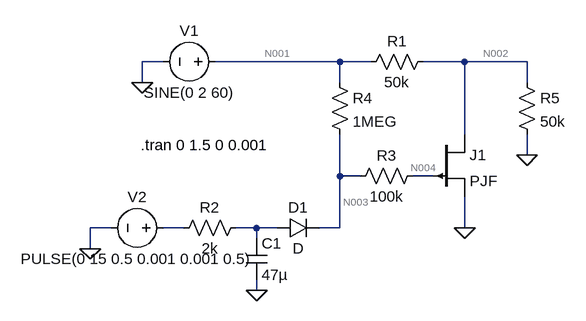
[diagram p0: schematic mute2.asc]
mute2.asc, the LTspice schematic file:
Version 4
SHEET 1 880 680
WIRE -304 -16 -336 -16
WIRE -32 -16 -224 -16
WIRE 16 -16 -32 -16
WIRE 160 -16 96 -16
WIRE 256 -16 160 -16
WIRE -336 16 -336 -16
WIRE -32 16 -32 -16
WIRE 256 16 256 -16
WIRE 160 96 160 -16
WIRE 256 128 256 96
WIRE -32 160 -32 96
WIRE 0 160 -32 160
WIRE 112 160 80 160
WIRE -384 240 -416 240
WIRE -272 240 -304 240
WIRE -160 240 -192 240
WIRE -128 240 -160 240
WIRE -32 240 -32 160
WIRE -32 240 -64 240
WIRE 160 240 160 192
WIRE -160 256 -160 240
WIRE -416 272 -416 240
WIRE -160 336 -160 320
FLAG -336 16 0
FLAG 256 128 0
FLAG -416 272 0
FLAG -160 336 0
FLAG 160 240 0
SYMBOL voltage -208 -16 R90
WINDOW 0 -32 56 VBottom 2
WINDOW 3 32 56 VTop 2
WINDOW 123 0 0 Left 2
WINDOW 39 0 0 Left 2
SYMATTR InstName V1
SYMATTR Value SINE(0 2 60)
SYMBOL voltage -288 240 R90
WINDOW 0 -32 56 VBottom 2
WINDOW 3 32 56 VTop 2
WINDOW 123 0 0 Left 2
WINDOW 39 0 0 Left 2
SYMATTR InstName V2
SYMATTR Value PULSE(0 15 0.5 0.001 0.001 0.5)
SYMBOL cap -176 256 R0
SYMATTR InstName C1
SYMATTR Value 47µ
SYMBOL res -176 224 R90
WINDOW 0 0 56 VBottom 2
WINDOW 3 32 56 VTop 2
SYMATTR InstName R2
SYMATTR Value 2k
SYMBOL diode -128 256 R270
WINDOW 0 32 32 VTop 2
WINDOW 3 0 32 VBottom 2
SYMATTR InstName D1
SYMBOL res 96 144 R90
WINDOW 0 0 56 VBottom 2
WINDOW 3 32 56 VTop 2
SYMATTR InstName R3
SYMATTR Value 100k
SYMBOL res -48 0 R0
SYMATTR InstName R4
SYMATTR Value 1MEG
SYMBOL res 240 0 R0
SYMATTR InstName R5
SYMATTR Value 50k
SYMBOL pjf 112 96 R0
SYMATTR InstName J1
SYMBOL res 112 -32 R90
WINDOW 0 0 56 VBottom 2
WINDOW 3 32 56 VTop 2
SYMATTR InstName R1
SYMATTR Value 50k
TEXT -338 112 Left 2 !.tran 0 1.5 0 0.001

The netlist it stands for:
* mute2.asc
V1 N001 0 SINE(0 2 60)
V2 N005 0 PULSE(0 15 0.5 0.001 0.001 0.5)
C1 N006 0 47µ
R2 N006 N005 2k
D1 N006 N003 D
R3 N004 N003 100k
R4 N001 N003 1MEG
R5 N002 0 50k
J1 N002 N004 0 PJF
R1 N002 N001 50k
.model D D
.lib standard.dio
.model NJF NJF
.model PJF PJF
.lib standard.jft
.tran 0 1.5 0 0.001
.backanno
.end

* Results of the author's LTspice run, read from the files saved beside the schematic
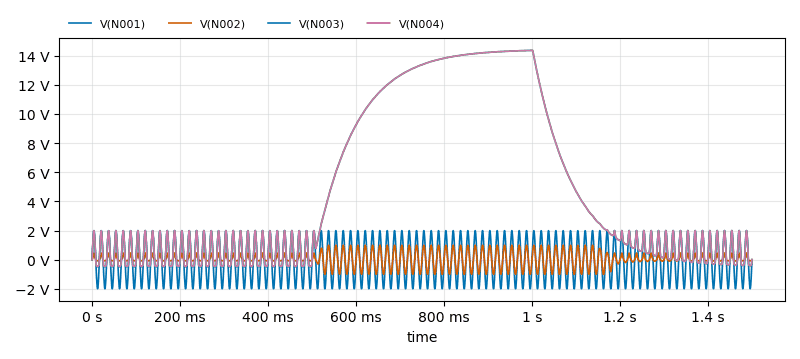
[diagram p1: Transient Analysis of mute2.asc, plotted from the saved traces]
* Transient Analysis, 1 run:
*   V(N001): min -1.994 V, max 1.995 V, average -867.7 µV, rms 1.398 V, last 0 V
*   V(N002): min -996.9 mV, max 997.5 mV, average 40.02 mV, rms 482.3 mV, last 0 V
*   V(N003): min -481.2 mV, max 14.35 V, average 4.925 V, rms 7.501 V, last 0 V
*   V(N004): min -447.2 mV, max 14.35 V, average 4.929 V, rms 7.501 V, last 0 V